# EAGLE design ATTINY44 (EAGLE 7.2.0)
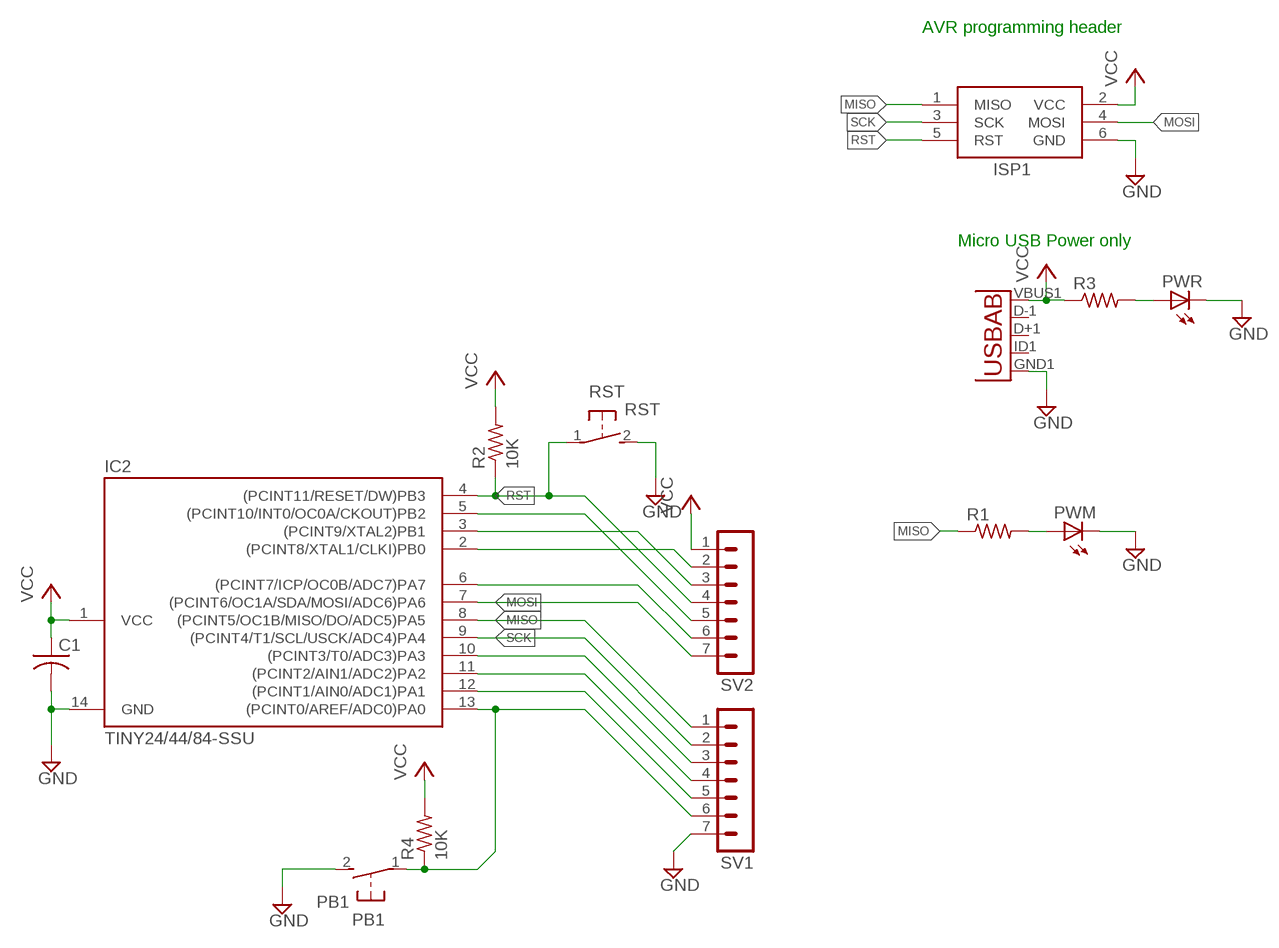
[diagram p0: schematic, sheet 1]

## Parts
C1  C-USC0805  [C0805]
IC2  TINY24/44/84-SSU  [SOIC14]
ISP1  AVRISP-6  [AVRISP]
PB1  PB1  DTSM-3  [DTSM-3]
PWM  LEDCHIPLED_0805  [CHIPLED_0805]
PWR  LEDCHIPLED_0805  [CHIPLED_0805]
R1  R-US_R0805  [R0805]
R2  10K  R-US_R0805  [R0805]
R3  R-US_R0805  [R0805]
R4  10K  R-US_R0805  [R0805]
RST  RST  DTSM-3  [DTSM-3]
SV1  MA07-1  [MA07-1]
SV2  MA07-1  [MA07-1]
U1  USB""  [USB-MICRO-SMD]

## Nets
GND: C1.2 IC2.14(GND) ISP1.6(GND) PB1.2 PWM.C PWR.C RST.2 SV1.7 U1.GND1(GND)
MISO: IC2.8((PCINT5/OC1B/MISO/DO/ADC5)PA5) ISP1.1(MISO) R1.1 SV1.1
MOSI: IC2.7((PCINT6/OC1A/SDA/MOSI/ADC6)PA6) ISP1.4(MOSI) SV2.7
N$1: PWR.A R3.2
N$2: PWM.A R1.2
N$3: IC2.2((PCINT8/XTAL1/CLKI)PB0) SV2.2
N$4: IC2.3((PCINT9/XTAL2)PB1) SV2.3
N$5: IC2.5((PCINT10/INT0/OC0A/CKOUT)PB2) SV2.5
N$6: IC2.6((PCINT7/ICP/OC0B/ADC7)PA7) SV2.6
PIN10: IC2.10((PCINT3/T0/ADC3)PA3) SV1.3
PIN11: IC2.11((PCINT2/AIN1/ADC2)PA2) SV1.4
PIN12: IC2.12((PCINT1/AIN0/ADC1)PA1) SV1.5
PIN13: IC2.13((PCINT0/AREF/ADC0)PA0) PB1.1 R4.1 SV1.6
RST: IC2.4((PCINT11/RESET/DW)PB3) ISP1.5(RST) R2.1 RST.1 SV2.4
SCK: IC2.9((PCINT4/T1/SCL/USCK/ADC4)PA4) ISP1.3(SCK) SV1.2
VCC: C1.1 IC2.1(VCC) ISP1.2(VCC) R2.2 R3.1 R4.2 SV2.1 U1.VBUS1(VBUS)
Unconnected: U1.D+1(D+) U1.D-1(D-) U1.ID1(USBID)

## Notes on the sheet
- AVR programming header
- Micro USB Power only

## Library data of the parts
C1 = rcl:C-US: CAPACITOR, American symbol
IC2 = avr-5:TINY24/44/84
ISP1 = adafruit:AVRISP: AVR ISP HEADER Standard 6 pin header for AVR programming
PB1 RST = switch-tact:DTSM-3
PWM PWR = adafruit:LED: LED OSRAM: - CHIPLED LG R971, LG N971, LY N971, LG Q971, LY Q971, LO R971, LY R971 LH N974, LH R974 LS Q976, LO Q976, LY Q976 LO Q996 - Hyper CHIPLED LW Q18S LB Q993, LB Q99A, LB R99A - SideLED LS A670, LO A670, LY A670, LG A670, LP A670 LB A673, LV A673, LT A673, LW A673 LH A674 LY A675 LS A676, LA A676, LO A676, LY A676, LW A676 LS A679, LY A679, LG A679 - Hyper Micro SIDELED® LS Y876, LA Y876, LO Y876, LY Y876 LT Y87S - SmartLED LW L88C, LW L88S LB L89C, LB L89S, LG L890 LS L89K, LO L89K, LY L89K LS L896, LA L896, LO L896, LY L896 - TOPLED LS T670, LO T670, LY T670, LG T670, LP T670 LSG T670, LSP T670, LSY T670, LOP T670, LYG T670 LG T671, LOG T671, LSG T671 LB T673, LV T673, LT T673, LW T673 LH T674 LS T676, LA T676, LO T676, LY T676, LB T676, LH T676, LSB T676, LW T676 LB T67C, LV T67C, LT T67C, LS T67K, LO T67K, LY T67K, LW E67C LS E67B, LA E67B, LO E67B, LY E67B, LB E67C, LV E67C, LT E67C LW T67C LS T679, LY T679, LG T679 LS T770, LO T770, LY T770, LG T770, LP T770 LB T773, LV T773, LT T773, LW T773 LH T774 LS E675, LA E675, LY E675, LS T675 LS T776, LA T776, LO T776, LY T776, LB T776 LHGB T686 LT T68C, LB T68C - Hyper Mini TOPLED® LB M676 - Mini TOPLED Santana® LG M470 LS M47K, LO M47K, LY M47K Source: http://www.osram.convergy.de/
R1-R4 = rcl:R-US_: RESISTOR, American symbol
SV1 SV2 = con-lstb:MA07-1: PIN HEADER; OC_FARNELL: unknown; OC_NEWARK: unknown
U1 = MicroUSB:USB: This is a USB AB connector that is compatible with USB OTG. i.e. this connector can serve as a host or device

## Board
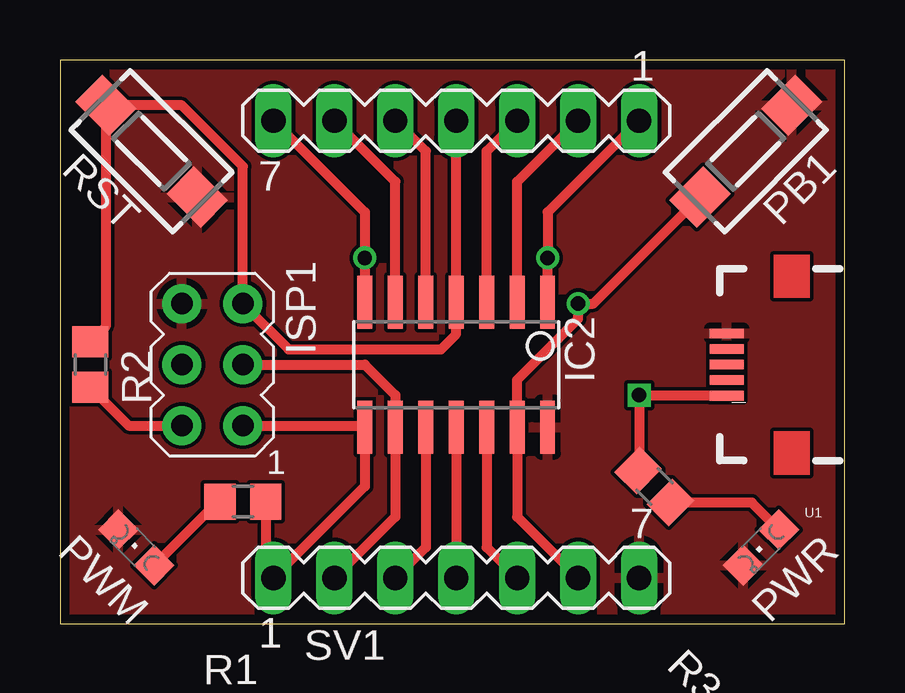
[diagram p1: board, top side]
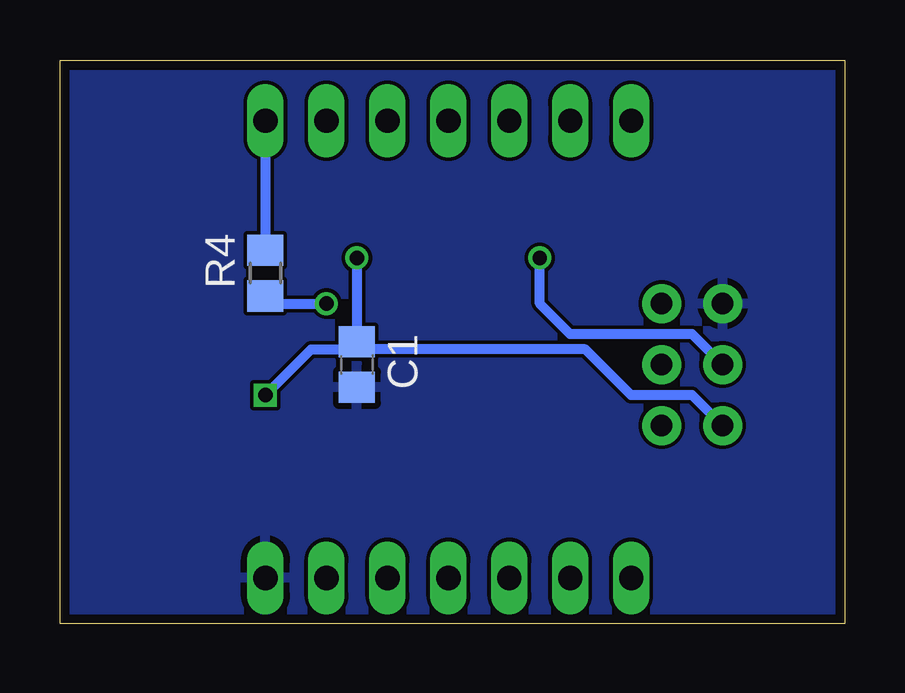
[diagram p2: board, bottom side, seen from below]

Size 32.69 x 23.48 mm. Coordinates in mm from the lower left corner, seen from the top.
Outline: 0,0 32.69,0 32.69,23.48 0,23.48 0,0
Copper layers (1*16): Top 0.0356mm / dielectric 1.5011mm / Bottom 0.0356mm
Design rules "OSHParkDRC": minimum track width 6mil, minimum drill 13mil, track to track 6mil, track to pad 6mil, pad to pad 6mil, via to via 6mil, smd to smd 6mil, copper to edge 15mil, drill to drill 6mil, minimum pad ring 7mil, minimum via ring 7mil, stop-mask expansion 3mil, vias tented up to drill 0mil, thermal gap 10mil

### Footprints (pad centres in the part's own frame; a part is rotated, then mirrored left to right if it is on the bottom)
C0805 = smd 1.3 x 1.5: 1 -0.95,0; 2 0.95,0
SOIC14 = smd 0.61 x 2.21: 1 -3.81,-2.603; 2 -2.54,-2.603; 3 -1.27,-2.603; 4 0,-2.603; 5 1.27,-2.603; 6 2.54,-2.603; 7 3.81,-2.603; 8 3.81,2.603; 9 2.54,2.603; 10 1.27,2.603; 11 0,2.603; 12 -1.27,2.603; 13 -2.54,2.603; 14 -3.81,2.603
AVRISP = drill 0.9 pad 1.626: 1 -1.27,2.54; 2 1.27,2.54; 3 -1.27,0; 4 1.27,0; 5 -1.27,-2.54; 6 1.27,-2.54
DTSM-3 = smd 2 x 1.6: 1 -2.7,0; 2 2.7,0
CHIPLED_0805 = smd 1.2 x 1.2: A 0,-1.05; C 0,1.05
R0805 = smd 1.3 x 1.5: 1 -0.95,0; 2 0.95,0
MA07-1 = drill 1.016 long: 1 -7.62,0; 2 -5.08,0; 3 -2.54,0; 4 0,0; 5 2.54,0; 6 5.08,0; 7 7.62,0
USB-MICRO-SMD = smd 1.4 x 0.4: D+1 2.7,0; D-1 2.7,0.65; GND1 2.7,-1.3; ID1 2.7,-0.65; VBUS1 2.7,1.3

### Placement (x,y rotation side)
C1  20.32,10.79 270 bottom
IC2  16.51,10.79 180 top
ISP1  6.35,10.79 180 top
PB1  28.57,19.68 45 top
PWM  3.17,3.17 45 top
PWR  29.21,3.17 135 top
R1  7.62,5.08 180 top
R2  1.27,10.79 270 top
R3  24.77,5.71 315 top
R4  24.13,14.61 90 bottom
RST  3.81,19.68 315 top
SV1  16.51,1.91 0 top
SV2  16.51,20.95 180 top
U1  30.48,10.79 180 top

### Tracks (layer width: path | path; a pad name or v marks a point on that pad's centre or on a via)
GND
  pour Top: 0,22.86 0,0 32.38,0 32.38,23.5 0,23.5
  pour Bottom: 33.02,0 0,0 0,20.32 0,22.86 33.02,22.86
MISO
  Top 0.406: ISP1.1 12.7,8.26 IC2.8 12.7,5.71 SV1.1 8.57,2.23 R1.1
MOSI  (via drill 0.6)
  Top 0.406: IC2.7 v12.7,15.24 12.7,17.14 SV2.7
  Bottom 0.406: ISP1.4 6.35,12.06 11.43,12.06 12.7,13.34 v12.7,15.24
N$1
  Top 0.406: PWR.A 28.83,5.04 R3.2
N$2
  Top 0.406: PWM.A 6.57,5.08 R1.2
N$3
  Top 0.406: IC2.2 19.05,18.41 SV2.2
N$4
  Top 0.406: IC2.3 17.78,19.68 SV2.3
N$5
  Top 0.406: IC2.5 15.24,19.68 SV2.5
N$6
  Top 0.406: IC2.6 13.97,18.41 SV2.6
PIN10
  Top 0.406: IC2.10 15.24,3.17 SV1.3
PIN11
  Top 0.406: IC2.11 SV1.4
PIN12
  Top 0.406: IC2.12 17.78,3.17 SV1.5
PIN13  (via drill 0.6)
  Top 0.406: SV1.6 19.05,4.45 IC2.13 19.05,10.16 21.59,12.7 v21.59,13.34 22.23,13.34 PB1.1
  Bottom 0.406: R4.1 23.81,13.34 v21.59,13.34
RST
  Top 0.406: SV2.4 IC2.4 16.51,12.06 15.88,11.43 9.53,11.43 ISP1.5 7.62,19.05 5.08,21.59 RST.1 1.9,12.38 R2.1 1.75,12.22
SCK
  Top 0.406: ISP1.3 12.7,10.79 13.97,9.53 IC2.9 13.97,4.45 SV1.2
VCC  (via drill 0.6)
  Top 0.406: SV2.1 20.32,17.14 v20.32,15.24 | IC2.1 v20.32,15.24 | U1.VBUS1 24.16,9.49 v24.13,9.53 24.13,6.42 R3.1 | v20.32,15.24 20.36,15.2 | R2.2 2.86,8.26 ISP1.2
  Bottom 0.406: ISP1.2 6.35,9.53 8.89,9.53 10.79,11.43 20.32,11.43 C1.1 | v20.32,15.24 C1.1 | v24.13,9.53 22.23,11.43 20.64,11.43 C1.1 | SV2.1 R4.2